# Altium schematic sheet BMS.SchDoc
size A4; SheetNumber: 6; SheetTotal: 8
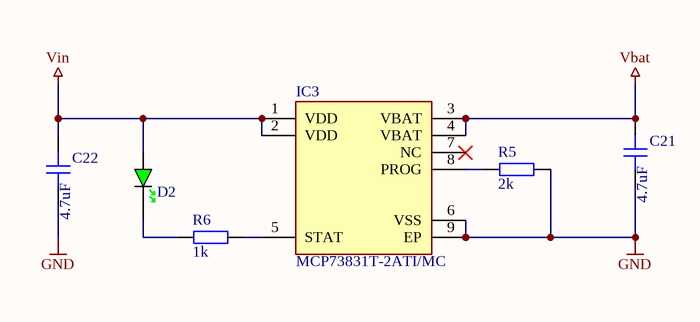
[diagram p0: BMS.SchDoc]

## Parts
C21  value 4.7uF  [CAP_0402]  (hidden comment: C0402_10V)
C22  value 4.7uF  [CAP_0402]  (hidden comment: C0402_10V)
D2  GREEN  [LED_0402_GREEN]  (value not drawn)
IC3  MCP73831T-2ATI/MC  [SON65P300X300X80-9N-D]
R5  value 2k  [RES_0402]  (hidden comment: R0402)
R6  value 1k  [RES_0402]  (hidden comment: R0402)

## Nets
GND: C21.1 C22.1 IC3.6(VSS) IC3.9(EP) R5.2
Vbat: C21.2 IC3.3(VBAT) IC3.4(VBAT)
Vin: C22.2 D2.A IC3.1(VDD) IC3.2(VDD)
NetD2_K: D2.K R6.1
NetIC3_5: IC3.5(STAT) R6.2
NetIC3_8: IC3.8(PROG) R5.1

Not connected (* = marked no-connect by the designer): IC3 7(NC)*

## Library data of the parts
C21 C22 = CAP_0402_10V: Capacitor SMD 0402 10V
D2 = LED_0402_GREEN: LED 0402 GREEN SMD
IC3 = MCP73831T-2ATI/MC: Battery Management Charge mgnt contr; Manufacturer_Name: Microchip; Datasheet Link: https://www.mouser.pl/datasheet/2/268/20001984g-846362.pdf; Manufacturer_Part_Number: MCP73831T-2ATI/MC; Mouser Part Number: 579-MCP73831T-2ATIMC
R5 R6 = RES_0402: Resistor SMD 0402; Manufacturer: *; Manufacturer Part Number: *; Distributor Link: *